# Altium project Optocoupler_module.PrjPcb
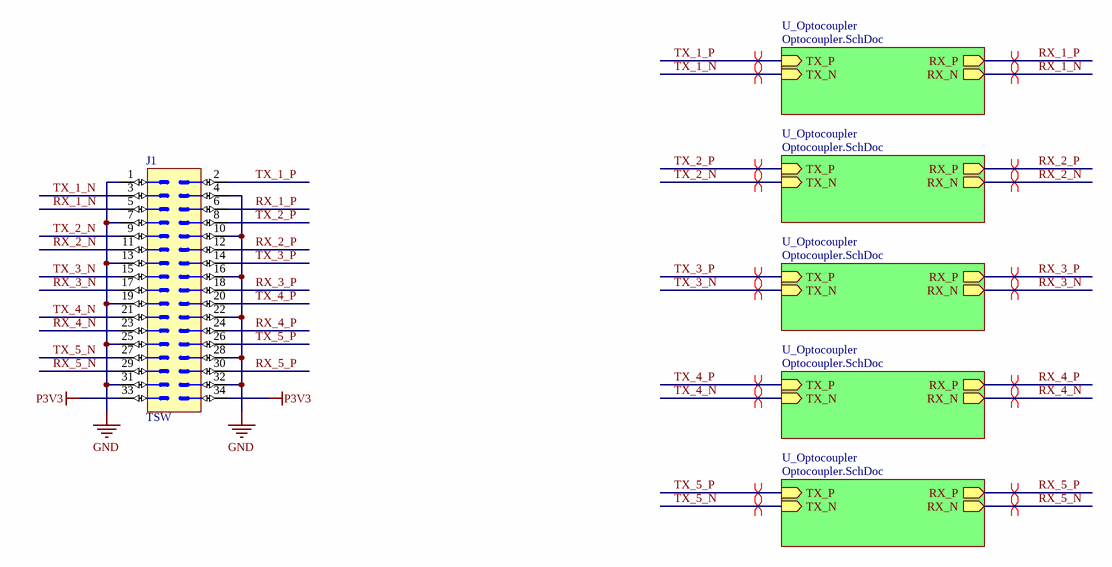
[diagram p0: Optocoupler_module.SchDoc]
2 sheets, 116 parts. Net scope: hierarchical (ports join the sheet entries above them; power ports are global).
Board file: Optocouplers.PcbDoc
Sheets:
  Optocoupler_module.SchDoc
    U_Optocoupler = Optocoupler.SchDoc
    U_Optocoupler = Optocoupler.SchDoc
    U_Optocoupler = Optocoupler.SchDoc
    U_Optocoupler = Optocoupler.SchDoc
    U_Optocoupler = Optocoupler.SchDoc

## Sheet Optocoupler_module.SchDoc: Optocoupler module
size A3; Author: M.Beldyga; CompanyName: WUT ISE; DrawnBy: M.Beldyga; Organization: WUT ISE; Address1: PW ISE; Address2: Nowowiejska 15/19 00-665 Warsaw; Address3: micbeldyga@gmail.com; SheetNumber: 1; SheetTotal: 2; ModifiedBy: -; CheckedDate: -; Title2: 7x AFBR-FS50B00; DivGrp: WUT ISE; Designer: M.Beldyga; ModifiedDate: -; ProjectName: Sensor Box

### Parts
J1  TSW  [SAMTEC_SW-117-08]

### Sub-sheets
U_Optocoupler = Optocoupler.SchDoc: TX_P (in), TX_N (in), RX_P (out), RX_N (out)
U_Optocoupler = Optocoupler.SchDoc: TX_P (in), TX_N (in), RX_P (out), RX_N (out)
U_Optocoupler = Optocoupler.SchDoc: TX_P (in), TX_N (in), RX_P (out), RX_N (out)
U_Optocoupler = Optocoupler.SchDoc: TX_P (in), TX_N (in), RX_P (out), RX_N (out)
U_Optocoupler = Optocoupler.SchDoc: TX_P (in), TX_N (in), RX_P (out), RX_N (out)

### Nets
GND: J1.1 J1.4 J1.7 J1.10 J1.13 J1.16 J1.19 J1.22 J1.25 J1.28 J1.31 J1.32
P3V3: J1.33 J1.34
RX_1_N: J1.5 ; sheet U_Optocoupler/RX_N
RX_1_P: J1.6 ; sheet U_Optocoupler/RX_P
RX_2_N: J1.11 ; sheet U_Optocoupler/RX_N
RX_2_P: J1.12 ; sheet U_Optocoupler/RX_P
RX_3_N: J1.17 ; sheet U_Optocoupler/RX_N
RX_3_P: J1.18 ; sheet U_Optocoupler/RX_P
RX_4_N: J1.23 ; sheet U_Optocoupler/RX_N
RX_4_P: J1.24 ; sheet U_Optocoupler/RX_P
RX_5_N: J1.29 ; sheet U_Optocoupler/RX_N
RX_5_P: J1.30 ; sheet U_Optocoupler/RX_P
TX_1_N: J1.3 ; sheet U_Optocoupler/TX_N
TX_1_P: J1.2 ; sheet U_Optocoupler/TX_P
TX_2_N: J1.9 ; sheet U_Optocoupler/TX_N
TX_2_P: J1.8 ; sheet U_Optocoupler/TX_P
TX_3_N: J1.15 ; sheet U_Optocoupler/TX_N
TX_3_P: J1.14 ; sheet U_Optocoupler/TX_P
TX_4_N: J1.21 ; sheet U_Optocoupler/TX_N
TX_4_P: J1.20 ; sheet U_Optocoupler/TX_P
TX_5_N: J1.27 ; sheet U_Optocoupler/TX_N
TX_5_P: J1.26 ; sheet U_Optocoupler/TX_P

### Layout directives
differential pair; net class D100: RX_1_N, RX_1_P, RX_2_N, RX_2_P, RX_3_N, RX_3_P, RX_4_N, RX_4_P, RX_5_N, RX_5_P, TX_1_N, TX_1_P, TX_2_N, TX_2_P, TX_3_N, TX_3_P, TX_4_N, TX_4_P, TX_5_N, TX_5_P

### Notes on the sheet
- Project/Equipment
- Document
- Designer
- Drawn by
- Check.by
- Contact
- File
- Last Mod.
- Print Date
- Sheet
- Size
- A3
- of
- Rev

### Library data of the parts
J1 = TSW-117-08-T-D-RA: Connector 34 Male; Part Description: Classic PCB Header Strips, 0.100" pitch; Manufacturer: SAMTEC; PressFit: No; Part Number: TSW-117-08-T-D-RA; Component Kind: Standard; Component Type: Standard; Pin Count: 34; Family: TSW; SMD: No; Status: Active; Manufacturer Part Number: TSW-117-08-T-D-RA; ComponentHeight: 5.56mm; Author: Michal Beldyga; CreateDate: 2/18/2025; LatestRevisionDate: 2/18/2025

## Sheet Optocoupler.SchDoc: Optocoupler
size A3; Author: M.Beldyga; CompanyName: WUT ISE; DrawnBy: M.Beldyga; Organization: WUT ISE; Address1: PW ISE; Address2: Nowowiejska 15/19 00-665 Warsaw; Address3: micbeldyga@gmail.com; SheetNumber: 2; SheetTotal: 2; ModifiedBy: -; CheckedDate: -; DivGrp: WUT ISE; Designer: M.Beldyga; ModifiedDate: -; ProjectName: Sensor Box
Used 5 times, as channels U_Optocoupler, U_Optocoupler, U_Optocoupler, U_Optocoupler, U_Optocoupler. Parts and nets are listed once, with the designators drawn on the sheet.
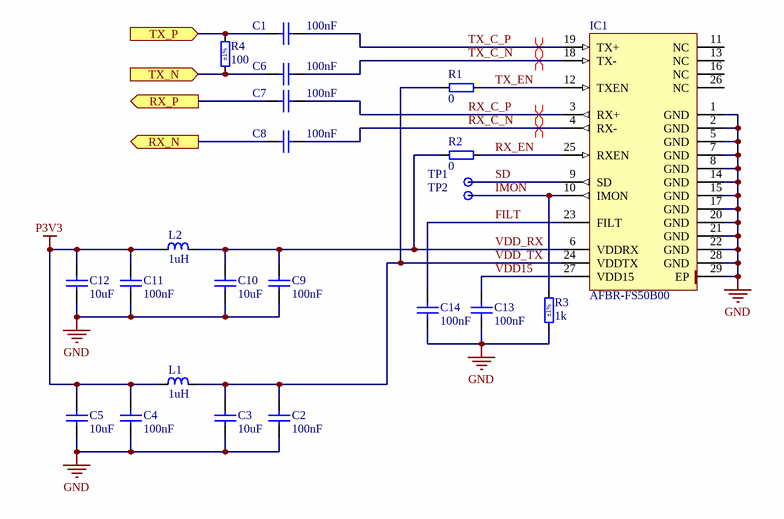
[diagram p1: Optocoupler.SchDoc]

### Parts
C1  100nF  [CAPC1005X55N]
C2  100nF  [CAPC1005X55N]
C3  10uF  [CAPC1005X55N]
C4  100nF  [CAPC1005X55N]
C5  10uF  [CAPC1005X55N]
C6  100nF  [CAPC1005X55N]
C7  100nF  [CAPC1005X55N]
C8  100nF  [CAPC1005X55N]
C9  100nF  [CAPC1005X55N]
C10  10uF  [CAPC1005X55N]
C11  100nF  [CAPC1005X55N]
C12  10uF  [CAPC1005X55N]
C13  100nF  [CAPC1005X55N]
C14  100nF  [CAPC1005X55N]
IC1  AFBR-FS50B00  [BROADCOM_AFBR-FS50B00]
L1  1uH  [INDC1005X55N]
L2  1uH  [INDC1005X55N]
R1  0  [RESC1005X40N]
R2  0  [RESC1005X40N]
R3  1k  Tolerance: ±1%  [RESC1005X40N]
R4  100  Tolerance: ±1%  [RESC1005X40N]
TP1  Test Point  [TPS127]  (value not drawn)
TP2  Test Point  [TPS127]  (value not drawn)

### Ports
RX_N (out), RX_P (out), TX_N (in), TX_P (in)

### Nets
GND: C2.1 C3.1 C4.1 C5.1 C9.1 C10.1 C11.1 C12.1 C13.1 C14.1 IC1.1(GND) IC1.2(GND) IC1.5(GND) IC1.7(GND) IC1.8(GND) IC1.14(GND) IC1.15(GND) IC1.17(GND) IC1.20(GND) IC1.21(GND) IC1.22(GND) IC1.28(GND) IC1.29(EP) R3.1
P3V3: C4.2 C5.2 C11.2 C12.2 L1.2 L2.2
FILT: C14.2 IC1.23(FILT)
IMON: IC1.10(IMON) R3.2 TP2.1
RX_C_N: C8.1 IC1.4(RX-)
RX_C_P: C7.1 IC1.3(RX+)
RX_EN: IC1.25(RXEN) R2.2
RX_N: C8.2 ; port RX_N
RX_P: C7.2 ; port RX_P
SD: IC1.9(SD) TP1.1
TX_C_N: C6.1 IC1.18(TX-)
TX_C_P: C1.1 IC1.19(TX+)
TX_EN: IC1.12(TXEN) R1.2
TX_N: C6.2 R4.1 ; port TX_N
TX_P: C1.2 R4.2 ; port TX_P
VDD15: C13.2 IC1.27(VDD15)
VDD_RX: C9.2 C10.2 IC1.6(VDDRX) L2.1 R2.1
VDD_TX: C2.2 C3.2 IC1.24(VDDTX) L1.1 R1.1

Not connected (* = marked no-connect by the designer): IC1 11(NC) 13(NC) 16(NC) 26(NC)

### Channels
U_Optocoupler: designators end in E; ports RX_N=RX_5_N RX_P=RX_5_P TX_N=TX_5_N TX_P=TX_5_P
U_Optocoupler: designators end in D; ports RX_N=RX_4_N RX_P=RX_4_P TX_N=TX_4_N TX_P=TX_4_P
U_Optocoupler: designators end in C; ports RX_N=RX_3_N RX_P=RX_3_P TX_N=TX_3_N TX_P=TX_3_P
U_Optocoupler: designators end in B; ports RX_N=RX_2_N RX_P=RX_2_P TX_N=TX_2_N TX_P=TX_2_P
U_Optocoupler: designators end in A; ports RX_N=RX_1_N RX_P=RX_1_P TX_N=TX_1_N TX_P=TX_1_P

### Layout directives
differential pair; net class D100: RX_C_N_U_Optocoupler, RX_C_P_U_Optocoupler, TX_C_N_U_Optocoupler, TX_C_P_U_Optocoupler

### Notes on the sheet
- Project/Equipment
- Document
- Designer
- Drawn by
- Check.by
- Contact
- File
- Last Mod.
- Print Date
- Sheet
- Size
- A3
- of
- Rev

### Library data of the parts
C1 C2 C4 C6-C9 C11 C13 C14 = CC0402_100NF_50V_10%_X7R: Non-polarised capacitor; Part Description: SMD Multilayer Chip Ceramic Capacitor; Manufacturer: GENERIC; Manufacturer1 Part Number: GRM155R71H104KE14D; Voltage: 50V; TC: X7R; Tolerance: ±10%; Part Number: CC0402_100NF_50V_10%_X7R; Component Kind: Standard; Component Type: Standard; Pin Count: 2; Value: 100nF; Status: None; Manufacturer Part Number: CC0402_100NF_50V_10%_X7R; Case: 0402; Mounted: Yes; Socket: No; SMD: Yes; Sense: No; Manufacturer1 Example: MURATA; Manufacturer1 ComponentHeight: 0.55mm; HelpURL: \\cern.ch\dfs\Applications\Altium\Datasheets\CC0402_MURATA_GRM155R71H104KE14D.pdf; Author: CERN DEM MR; CreateDate: 6/30/2017; LatestRevisionDate: 6/30/2017
C3 C5 C10 C12 = CC0402_10UF_6.3V_20%_X5R: SMD Mulitlayer Ceramic Chip Capacitor; Manufacturer: GENERIC; Manufacturer 1: Murata; Manufacturer 1 Part Number: GRM155R60J106ME15D; Manufacturer 2 Part Number: CL05A106MQ5NUNC; Manufacturer 3 Part Number: CC0402MRX5R5BB106; Voltage: 6.3V; TC: X5R; Tolerance: ±20%; Part Number: CC0402_10UF_6.3V_20%_X5R; Component Kind: Standard; Component Type: Standard; Pin Count: 2; Value: 10uF; Manufacturer Part Number: CC0402_10UF_6.3V_20%_X5R; Case: 0402; Status: None; ComponentHeight: 0.55mm; SMD: Yes; Manufacturer 2: Samsung; Manufacturer 3: YAGEO; Author: Michal Beldyga; CreateDate: 10/28/2024; LatestRevisionDate: 10/28/2024
IC1 = AFBR-FS50B00: High Voltage Galvanic Insulation Link for DC to 5MBaud; Part Description: Transceiver Module Optical 5Gbps 3.3V Surface Mount; Manufacturer: BROADCOM; PressFit: No; Bonding: No; Part Number: AFBR-FS50B00; Component Kind: Standard; Component Type: Standard; Device: AFBR-FS50B00; PackageDescription: BROADCOM AFBR-FS50B00 Case, Body 5.25mm L X 5.25mm W X 4.83mm H; Manufacturer Part Number: AFBR-FS50B00; Pin Count: 29; Mounted: Yes; Socket: No; SMD: No; Sense: No; ComponentHeight: 4.83mm; HelpURL: \\cern.ch\dfs\Applications\Altium\Datasheets\AFBR-FS50B00.pdf; Author: CERN DEM HF; CreateDate: 12/10/2024; LatestRevisionDate: 12/10/2024
L1 L2 = IND0402_1UH_5%_TDK_MLZ1005M1R0WT000: Inductor; Part Description: FIXED IND 1UH 450MA 350 MOHM SMD; Manufacturer: TDK; Current: 100mA; DC Resistance: 350mΩ; Tolerance: ±20%; Part Number: IND0402_1UH_5%_TDK_MLZ1005M1R0WT000; Component Kind: Standard; Component Type: Standard; Pin Count: 2; Value: 1uH; Manufacturer Part Number: MLZ1005M1R0WT000; Status: Active; ComponentHeight: 0.5mm; SMD: Yes; Author: Michal Beldyga; CreateDate: 2/17/2025; LatestRevisionDate: 2/17/2025
R1 R2 = R0402_0R_JUMPER: Resistor; Part Description: 1A (0.05R Max DC Resistance) Zero Ohm Jumper; Manufacturer: GENERIC; Manufacturer1 Part Number: 232270591001L; PressFit: No; Part Number: R0402_0R_JUMPER; Component Kind: Standard; Component Type: Standard; Pin Count: 2; Value: 0; Status: Not Recommended; Manufacturer Part Number: R0402_0R_JUMPER; Case: 0402; Mounted: Yes; Sense: No; Socket: No; SMD: Yes; Manufacturer1 Example: YAGEO PHYCOMP; Manufacturer1 ComponentHeight: 0.4mm; HelpURL: \\cern.ch\dfs\Applications\Altium\Datasheets\R0402_Phycomp_RC0402.pdf; Author: CERN DEM JLC; CreateDate: 12/3/2007; LatestRevisionDate: 10/17/2012
R3 = R0402_1K_1%_0.0625W_100PPM: Resistor - 1%; Part Description: General Purpose Thick Film Chip Resistor; Manufacturer: GENERIC; Manufacturer1 Part Number: 232270671002L; TC: ±100ppm/°C; PressFit: No; Part Number: R0402_1K_1%_0.0625W_100PPM; Component Kind: Standard; Component Type: Standard; Pin Count: 2; Value: 1k; Status: Not Recommended; Power: 0.0625W; Manufacturer Part Number: R0402_1K_1%_0.0625W_100PPM; Case: 0402; Mounted: Yes; Sense: No; Socket: No; SMD: Yes; Manufacturer1 Example: YAGEO PHYCOMP; Manufacturer1 ComponentHeight: 0.4mm; HelpURL: \\cern.ch\dfs\Applications\Altium\Datasheets\R0402_Phycomp_RC0402.pdf; Author: CERN DEM JLC; CreateDate: 12/3/2007; LatestRevisionDate: 10/17/2012
R4 = R0402_100R_1%_0.1W_100PPM: Resistor - 1%; Part Description: General Purpose Thick Film Chip Resistor; Manufacturer: GENERIC; Manufacturer Part Number: R0402_100R_1%_0.1W_100PPM_50V; Manufacturer1 Part Number: ERJ2RKF1000X; Power: 0.1W; TC: ±100ppm/°C; Voltage: 50V; PressFit: No; Part Number: R0402_100R_1%_0.1W_100PPM; Component Kind: Standard; Component Type: Standard; Pin Count: 2; Value: 100; Status: Not Recommended; Case: 0402; Mounted: Yes; Sense: No; Socket: No; SMD: Yes; Manufacturer1 Example: PANASONIC; Manufacturer1 ComponentHeight: 0.4mm; HelpURL: \\cern.ch\dfs\Applications\Altium\Datasheets\R0402_PANASONIC_ERJ2RK.pdf; Author: CERN DEM JLC; CreateDate: 12/12/2013; LatestRevisionDate: 3/3/2015
TP1 TP2 = SMD_PAD_1.27X1.27MM: Part Description: 1.27mm x 1.27mm PCB Copper Area (SMD Test Point); Mounted: No; Part Number: SMD_PAD_1.27X1.27MM; Component Kind: Standard (No BOM); Component Type: Standard (No BOM); Pin Count: 1; Family: Test Point; Socket: No; SMD: Yes; Sense: No; Status: None; ComponentHeight: 0mm; HelpURL: Undefined; Author: CERN DEM JLC; CreateDate: 1/12/2008; LatestRevisionDate: 1/12/2008; PackageDescription: 1.27mm x 1.27mm PCB Copper Area (SMD Test Point)

## Nets that join several sheets
GND: Optocoupler_module (12 pins), U_Optocoupler (24 pins), U_Optocoupler (24 pins), U_Optocoupler (24 pins), U_Optocoupler (24 pins), U_Optocoupler (24 pins)
P3V3: Optocoupler_module (J1.33 J1.34), U_Optocoupler (6 pins), U_Optocoupler (6 pins), U_Optocoupler (6 pins), U_Optocoupler (6 pins), U_Optocoupler (6 pins)
RX_1_N: Optocoupler_module (J1.5), U_Optocoupler (C8A.2)
RX_1_P: Optocoupler_module (J1.6), U_Optocoupler (C7A.2)
RX_2_N: Optocoupler_module (J1.11), U_Optocoupler (C8B.2)
RX_2_P: Optocoupler_module (J1.12), U_Optocoupler (C7B.2)
RX_3_N: Optocoupler_module (J1.17), U_Optocoupler (C8C.2)
RX_3_P: Optocoupler_module (J1.18), U_Optocoupler (C7C.2)
RX_4_N: Optocoupler_module (J1.23), U_Optocoupler (C8D.2)
RX_4_P: Optocoupler_module (J1.24), U_Optocoupler (C7D.2)
RX_5_N: Optocoupler_module (J1.29), U_Optocoupler (C8E.2)
RX_5_P: Optocoupler_module (J1.30), U_Optocoupler (C7E.2)
TX_1_N: Optocoupler_module (J1.3), U_Optocoupler (C6A.2 R4A.1)
TX_1_P: Optocoupler_module (J1.2), U_Optocoupler (C1A.2 R4A.2)
TX_2_N: Optocoupler_module (J1.9), U_Optocoupler (C6B.2 R4B.1)
TX_2_P: Optocoupler_module (J1.8), U_Optocoupler (C1B.2 R4B.2)
TX_3_N: Optocoupler_module (J1.15), U_Optocoupler (C6C.2 R4C.1)
TX_3_P: Optocoupler_module (J1.14), U_Optocoupler (C1C.2 R4C.2)
TX_4_N: Optocoupler_module (J1.21), U_Optocoupler (C6D.2 R4D.1)
TX_4_P: Optocoupler_module (J1.20), U_Optocoupler (C1D.2 R4D.2)
TX_5_N: Optocoupler_module (J1.27), U_Optocoupler (C6E.2 R4E.1)
TX_5_P: Optocoupler_module (J1.26), U_Optocoupler (C1E.2 R4E.2)